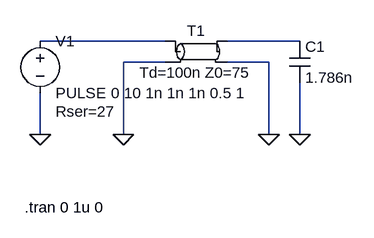
[diagram p0: schematic EC1_a.asc]
EC1_a.asc, the LTspice schematic file:
Version 4
SHEET 1 880 680
WIRE 160 32 -32 32
WIRE 368 32 256 32
WIRE 160 64 96 64
WIRE 320 64 256 64
WIRE -32 176 -32 112
WIRE 96 176 96 64
WIRE 320 176 320 64
WIRE 368 176 368 96
FLAG -32 176 0
FLAG 96 176 0
FLAG 320 176 0
FLAG 368 176 0
SYMBOL voltage -32 16 R0
WINDOW 123 0 0 Left 0
WINDOW 39 24 124 Left 2
SYMATTR InstName V1
SYMATTR Value PULSE 0 10 1n 1n 1n 0.5 1
SYMATTR SpiceLine Rser=27
SYMBOL cap 352 32 R0
SYMATTR InstName C1
SYMATTR Value 1.786n
SYMBOL tline 208 48 R0
SYMATTR InstName T1
SYMATTR Value Td=100n Z0=75
TEXT -56 288 Left 2 !.tran 0 1u 0

The netlist it stands for:
* EC1_a.asc
V1 N001 0 PULSE 0 10 1n 1n 1n 0.5 1 Rser=27
C1 N002 0 1.786n
T1 N001 0 N002 0 Td=100n Z0=75
.tran 0 1u 0
.backanno
.end